# Altium schematic sheet MicroController.SchDoc
size A3; SheetNumber: 2; SheetTotal: 3
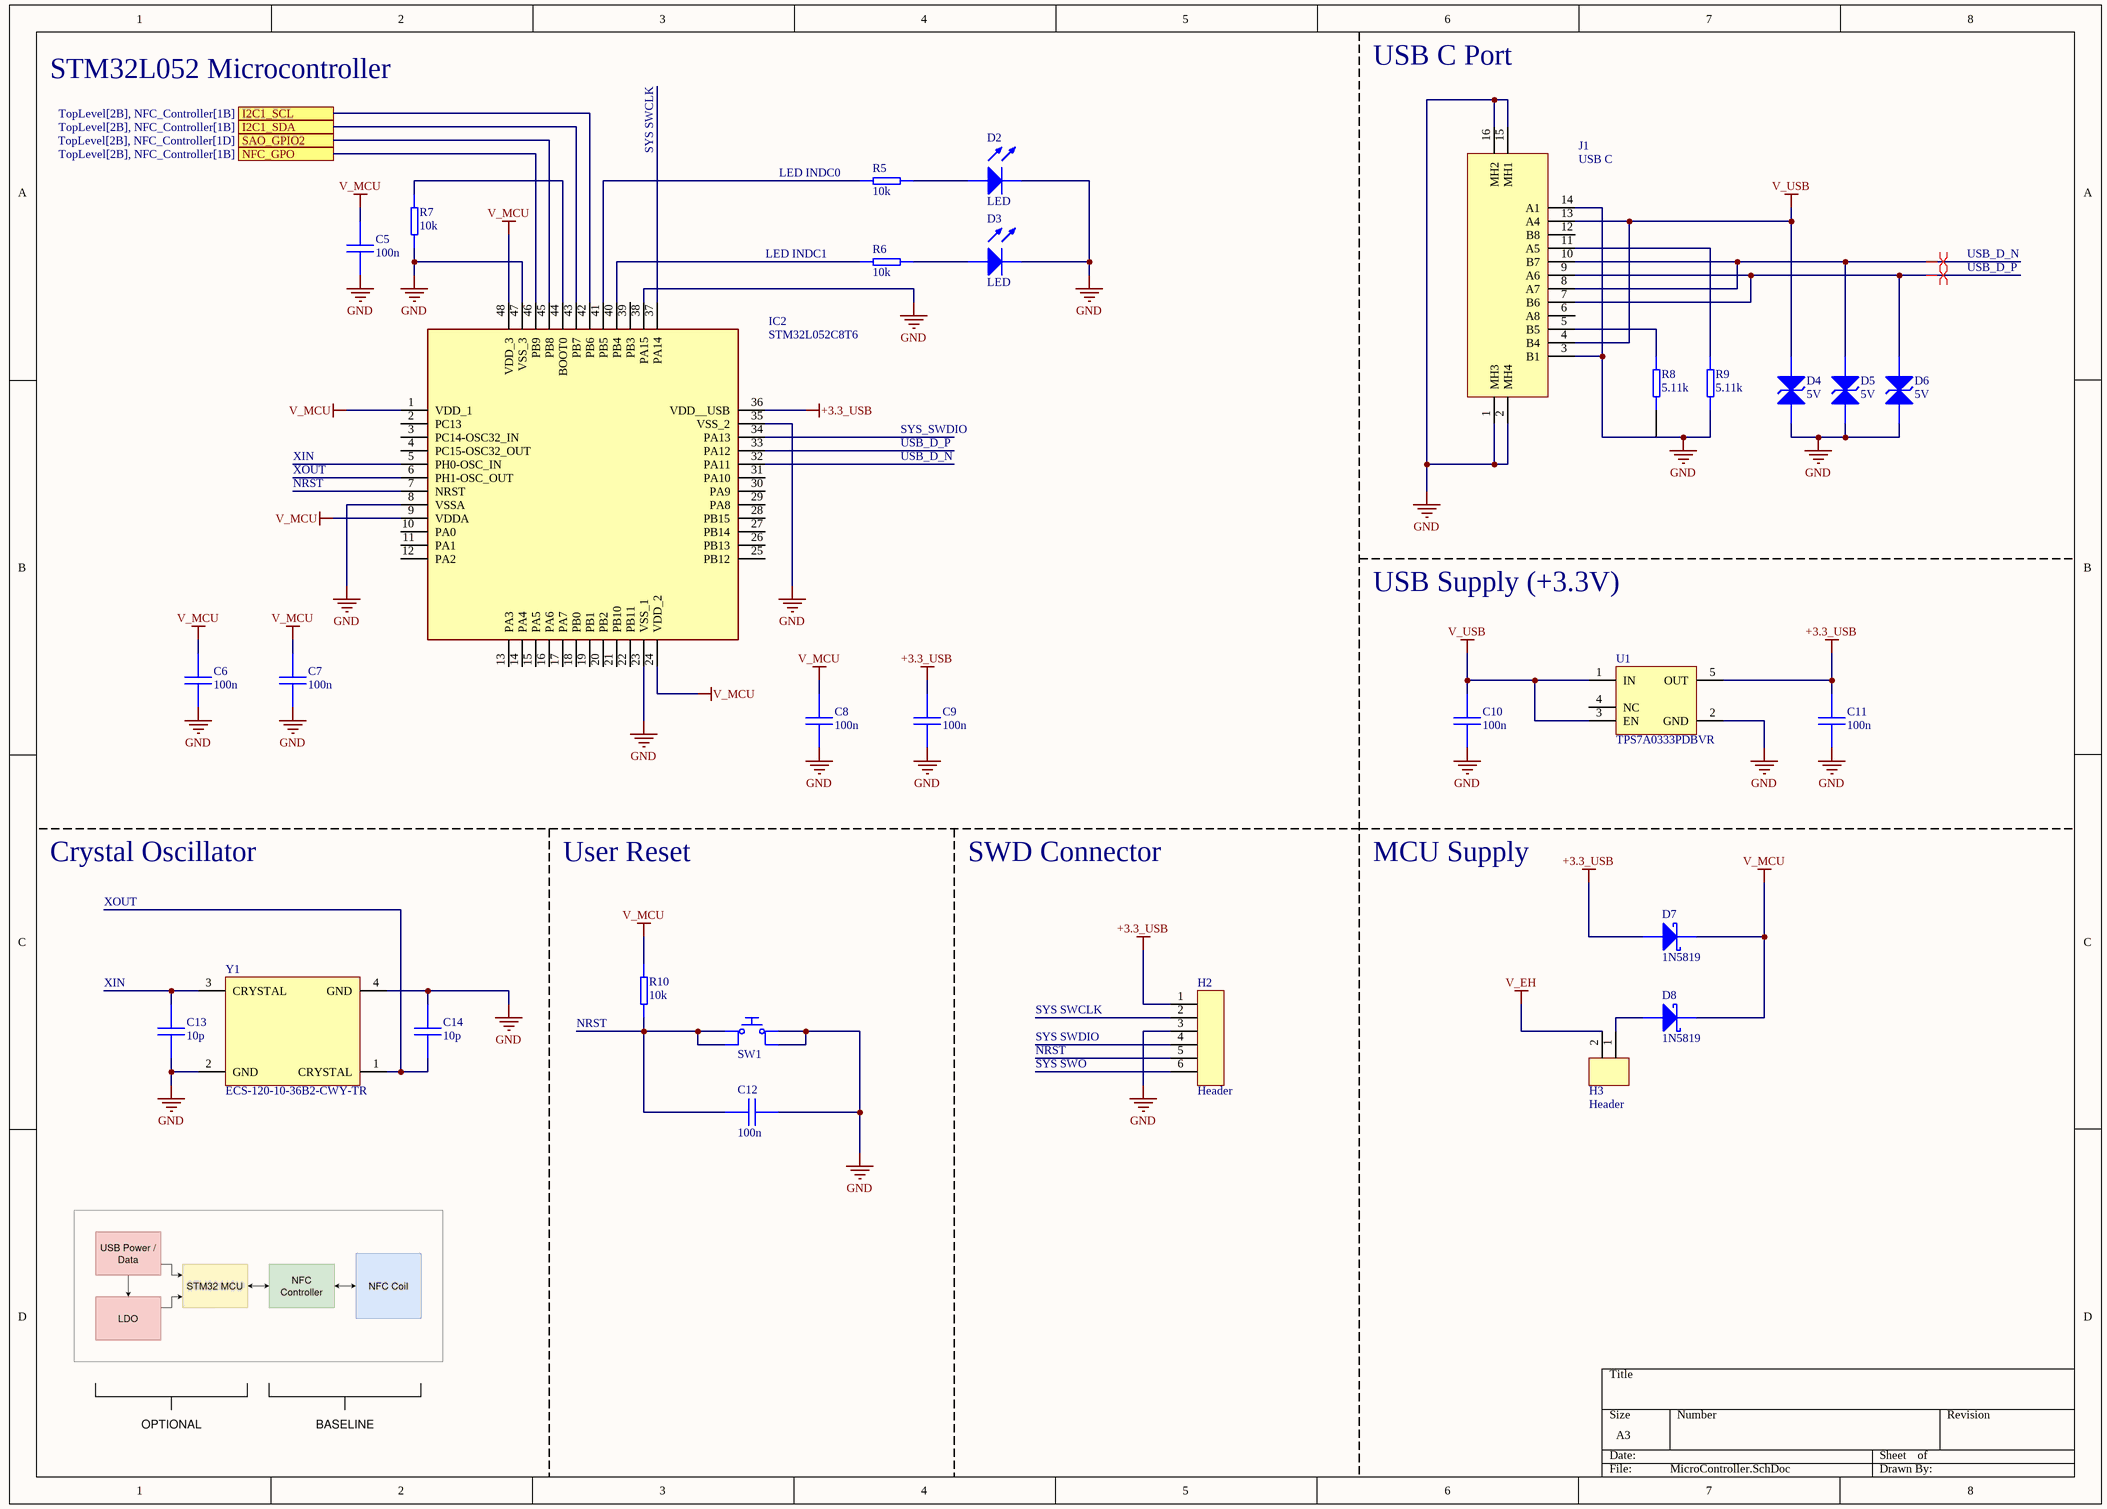
[diagram p0: MicroController.SchDoc]

## Parts
C5  100n  [CAP0805]
C6  100n  [CAP0805]
C7  100n  [CAP0805]
C8  100n  [CAP0805]
C9  100n  [CAP0805]
C10  100n  [CAP0805]
C11  100n  [CAP0805]
C12  100n  [CAP0805]
C13  10p  [CAP0402]
C14  10p  [CAP0402]
D2  LED  [LEDM2012X80N]
D3  LED  [LEDM2012X80N]
D4  5V  [SOD323]
D5  5V  [SOD323]
D6  5V  [SOD323]
D7  1N5819  [SOD323]
D8  1N5819  [SOD323]
H2  Header  [Header_1X6]
H3  Header  [Header_1X2]
IC2  STM32L052C8T6  [QFP50P900X900X160-48N]
J1  USB C  [USB TYPE C 12 PIN]
R5  10k  [RESC0805]
R6  10k  [RESC0805]
R7  10k  [RESC0805]
R8  5.11k  [RESC0805]
R9  5.11k  [RESC0805]
R10  10k  [RESC0805]
SW1  Tactile Switch - 1  [Tactile Button 4.2mm x 3.2mm]  (value not drawn)
U1  TPS7A0333PDBVR  [SOT23-5]
Y1  ECS-120-10-36B2-CWY-TR  [ECS1201036B2CWYTR]

## Ports
I2C1_SCL (see TopLevel[2B], NFC_Controller[1B]), I2C1_SDA (see TopLevel[2B], NFC_Controller[1B]), NFC_GPO (see TopLevel[2B], NFC_Controller[1B]), SAO_GPIO2 (see TopLevel[2B], NFC_Controller[1D])

## Nets
+3.3_USB: C9.1 C11.1 D7.2(A) H2.1 IC2.36(VDD__USB) U1.5(OUT)
GND: C5.2 C6.2 C7.2 C8.2 C9.2 C10.2 C11.2 C12.2 C13.2 C14.1 D2.1(K) D3.1(K) D4.1(A) D5.1(A) D6.1(A) H2.3 IC2.8(VSSA) IC2.23(VSS_1) IC2.35(VSS_2) IC2.38(PA15) IC2.47(VSS_3) J1.1(MH3) J1.2(MH4) J1.3(B1) J1.14(A1) J1.15(MH1) J1.16(MH2) R7.2 R9.2 SW1.3 SW1.4 U1.2(GND) Y1.2(GND) Y1.4(GND)
V_EH: H3.2
V_MCU: C5.1 C6.1 C7.1 C8.1 D7.1(K) D8.1(K) IC2.1(VDD_1) IC2.9(VDDA) IC2.24(VDD_2) IC2.48(VDD_3) R10.1
V_USB: C10.1 D4.2(K) J1.4(B4) J1.13(A4) U1.1(IN) U1.3(EN)
I2C1_SCL: IC2.42(PB6) ; port I2C1_SCL
I2C1_SDA: IC2.43(PB7) ; port I2C1_SDA
NFC_GPO: IC2.46(PB9) ; port NFC_GPO
SAO_GPIO2: IC2.45(PB8) ; port SAO_GPIO2
NetC12_1: C12.1 R10.2 SW1.1 SW1.2
NetC13_1: C13.1 Y1.3(CRYSTAL)
NetC14_2: C14.2 Y1.1(CRYSTAL)
NetD2_2: D2.2(A) R5.2
NetD3_2: D3.2(A) R6.2
NetD5_2: D5.2(K) J1.8(A7) J1.10(B7)
NetD6_2: D6.2(K) J1.7(B6) J1.9(A6)
NetD8_2: D8.2(A) H3.1
NetIC2_40: IC2.40(PB4) R6.1
NetIC2_41: IC2.41(PB5) R5.1
NetIC2_44: IC2.44(BOOT0) R7.1
NetJ1_5: J1.5(B5) R8.1
NetJ1_11: J1.11(A5) R9.1

Not connected (* = marked no-connect by the designer): H2 2 4 5 6; IC2 2(PC13) 3(PC14-OSC32_IN) 4(PC15-OSC32_OUT) 5(PH0-OSC_IN) 6(PH1-OSC_OUT) 7(NRST) 10(PA0) 11(PA1) 12(PA2) 13(PA3) 14(PA4) 15(PA5) 16(PA6) 17(PA7) 18(PB0) 19(PB1) 20(PB2) 21(PB10) 22(PB11) 25(PB12) 26(PB13) 27(PB14) 28(PB15) 29(PA8) 30(PA9) 31(PA10) 32(PA11) 33(PA12) 34(PA13) 37(PA14) 39(PB3); J1 6(A8) 12(B8); R8 2; U1 4(NC)

## Layout directives
differential pair: NetD5_2, NetD6_2

## Notes on the sheet
- STM32L052 Microcontroller
- USB C Port
- SYS SWCLK
- (near R5) LED INDC0
- LED INDC1
- USB_D_N
- USB_D_P
- SYS_SWDIO
- XIN
- XOUT
- NRST
- USB Supply (+3.3V)
- Crystal Oscillator
- User Reset
- SWD Connector
- MCU Supply
- (near R10) NRST
- SYS SWDIO
- SYS SWO

## Library data of the parts
C5-C11 = Capacitor - Non Polarized_2: Non Polarized Capacitor
C12 = Capacitor - Non Polarized: Non Polarized Capacitor
C13 C14 = Capacitor - Non Polarized_1: Non Polarized Capacitor
D2 D3 = LED: General Purpose LED; ComponentLink1Description: Datasheet; ComponentLink1URL: https://www.smc-diodes.com/propdf/1N4148W%20N0571%20REV.E.pdf
D4-D6 = TVS Diode
D7 D8 = 1N5819: 1N5819 Schottkey Diode
H2 = 6-Pin Header
H3 = 2-Pin Header
IC2 = STM32L052C8T6: Integrated Circuit; Manufacturer_Name: STMicroelectronics; Datasheet Link: http://www.st.com/content/ccc/resource/technical/document/datasheet/dc/d6/6d/24/86/2a/40/d3/DM00108217.pdf/files/DM00108217.pdf/jcr:content/translations/en.DM00108217.pdf; Height: 1.6mm; Manufacturer_Part_Number: STM32L052C8T6; Mouser Part Number: 511-STM32L052C8T6; Mouser Price/Stock: https://www.mouser.co.uk/ProductDetail/STMicroelectronics/STM32L052C8T6?qs=DqCdCwOw4%2F6IOKsu3MZAIw%3D%3D; Arrow Part Number: STM32L052C8T6; Arrow Price/Stock: https://www.arrow.com/en/products/stm32l052c8t6/stmicroelectronics?utm_currency=USD&region=nac
J1 = USB Type C Connector 12 Pin
R5 R6 R10 = Resistor
R7 = Resistor_2: Resistor
R8 R9 = Resistor_1: Resistor
SW1 = Tactile Switch - 1: Tactile Pushbutton - Contact Pad
U1 = TPS7A0333PDBVR: TPS7A03 Nanopower IQ, 200-nA, 200-mA, Low-Dropout Voltage Regulator With Fast / Transient Response; Manufacturer_Name: Texas Instruments; Datasheet Link: https://www.ti.com/lit/ds/symlink/tps7a03.pdf?HQS=dis-dk-null-digikeymode-dsf-pf-null-wwe&ts=1622188030827&ref_url=https%253A%252F%252Fwww.digikey.in%252F; Height: 1.45mm; Manufacturer_Part_Number: TPS7A0333PDBVR; Mouser Part Number: 595-TPS7A0333PDBVR; Mouser Price/Stock: https://www.mouser.co.uk/ProductDetail/Texas-Instruments/TPS7A0333PDBVR?qs=OlC7AqGiEDkyaMBNBZB82A%3D%3D; Arrow Part Number: TPS7A0333PDBVR; Arrow Price/Stock: https://www.arrow.com/en/products/tps7a0333pdbvr/texas-instruments?region=nac
Y1 = ECS-120-10-36B2-CWY-TR: Crystal or Oscillator; Manufacturer_Name: ECS; Datasheet Link: https://ecsxtal.com/store/pdf/ECX-2236B2.pdf; Height: 0.6mm; Manufacturer_Part_Number: ECS-120-10-36B2-CWY-TR; Mouser Part Number: 520-120-10-36B2CWYTR; Mouser Price/Stock: https://www.mouser.co.uk/ProductDetail/ECS/ECS-120-10-36B2-CWY-TR?qs=QNEnbhJQKva%2FwIO%2FvYs2yg%3D%3D; Arrow Part Number: ECS-120-10-36B2-CWY-TR; Arrow Price/Stock: https://www.arrow.com/en/products/ecs-120-10-36b2-cwy-tr/ecs-international.html?utm_currency=USD&region=europe